# EAGLE schematic Schematic v9 (EAGLE 9.7.0)
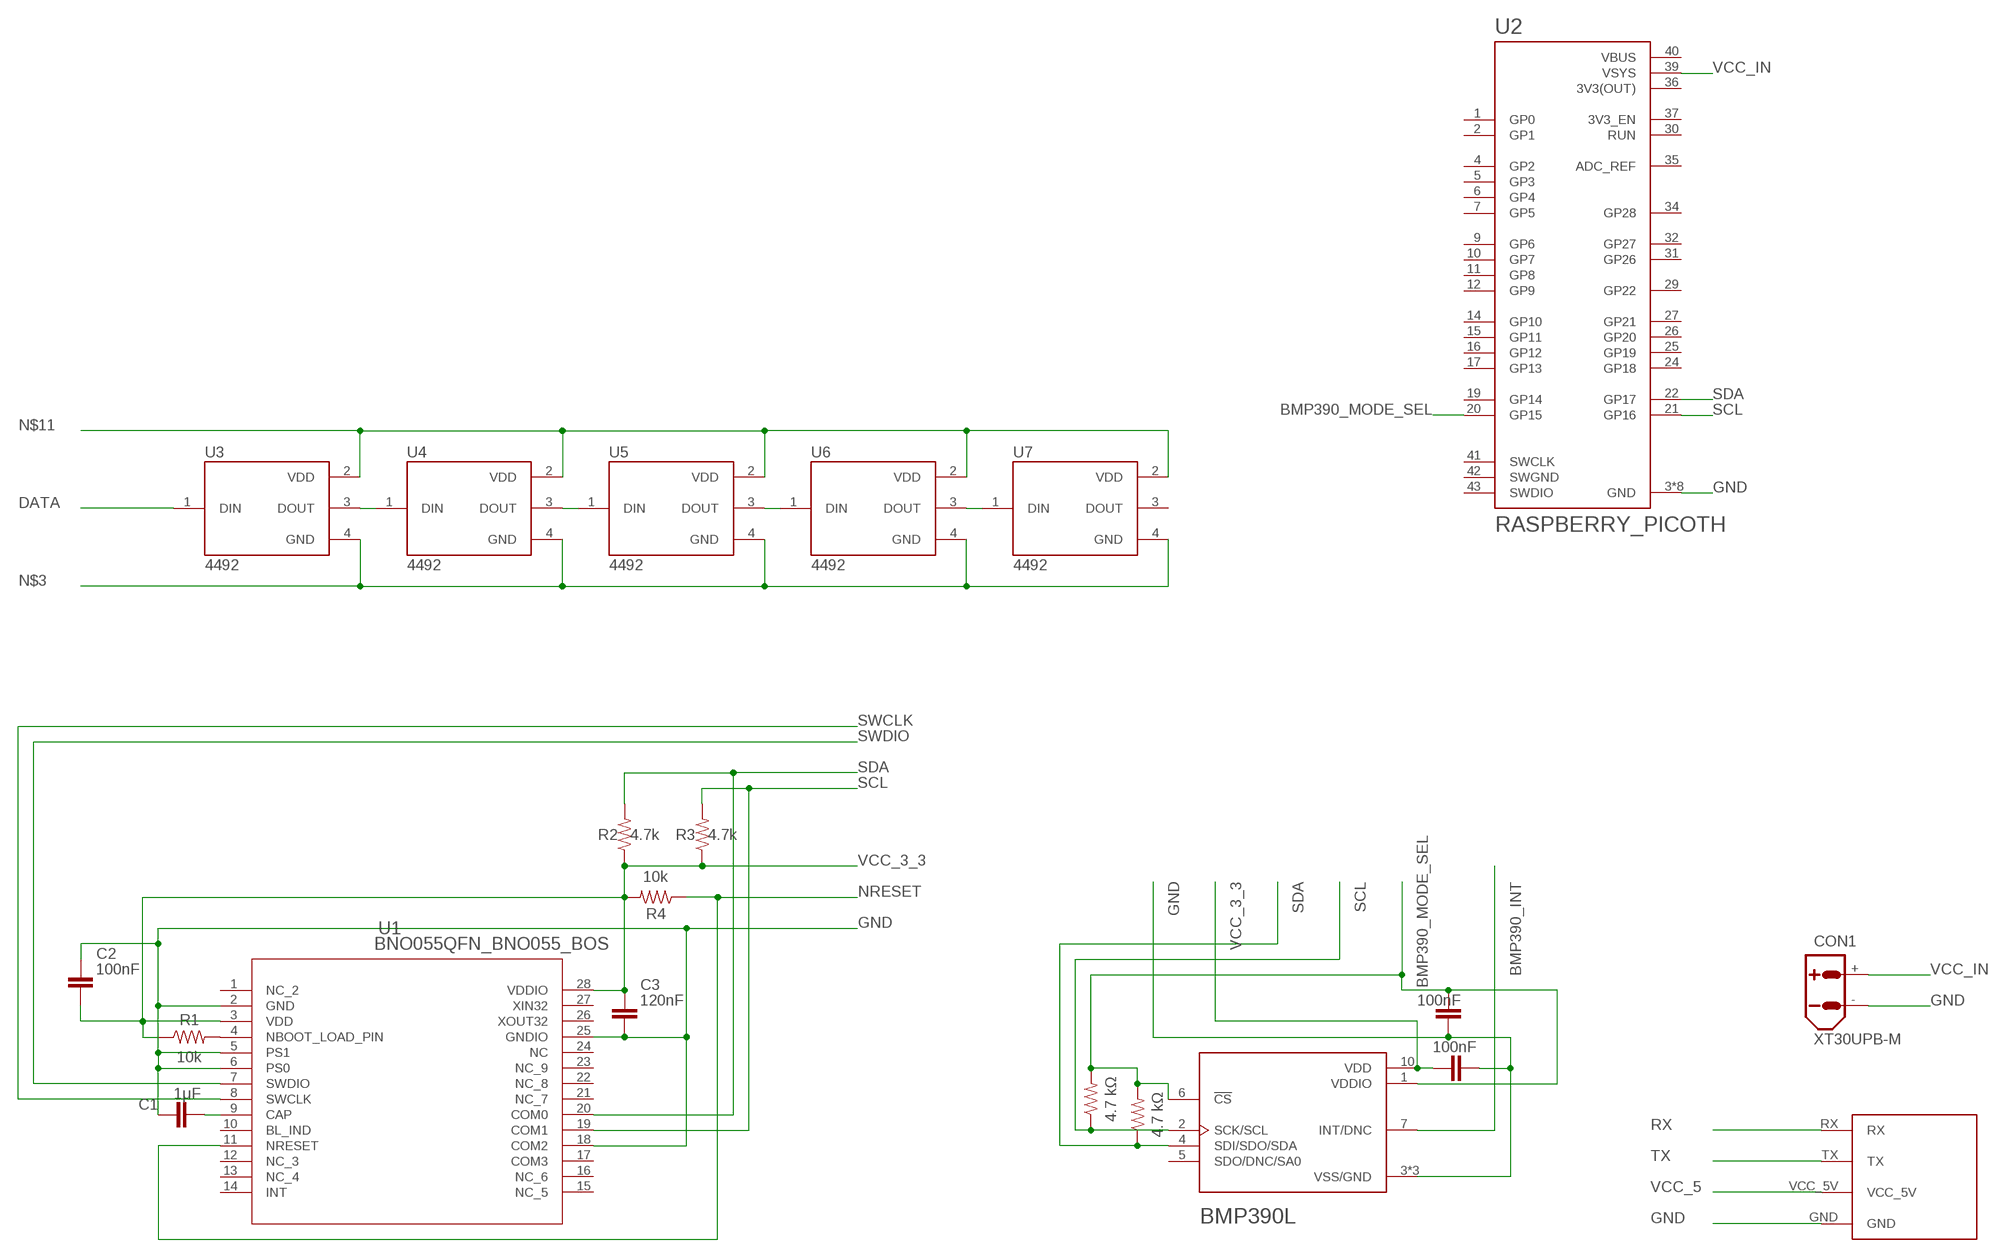
[diagram p0: schematic, sheet 1]

## Parts
C1  1μF  C_CHIP-1206(3216-METRIC)  [CAPC3216X135]
C2  100nF  C_CHIP-1206(3216-METRIC)  [CAPC3216X135]
C3  120nF  C_CHIP-1206(3216-METRIC)  [CAPC3216X135]
C4  100nF  C_CHIP-1206(3216-METRIC)  [CAPC3216X135]
C5  100nF  C_CHIP-1206(3216-METRIC)  [CAPC3216X135]
CON1  XT30UPB-M  [XT30UPB-M]
R1  10k  R-US_CHIP-1206(3216-METRIC)  [RESC3216X70]
R2  4.7k  R-US_CHIP-1206(3216-METRIC)  [RESC3216X70]
R3  4.7k  R-US_CHIP-1206(3216-METRIC)  [RESC3216X70]
R4  10k  R-US_CHIP-1206(3216-METRIC)  [RESC3216X70]
R5  4.7 kΩ  R-US_CHIP-1206(3216-METRIC)  [RESC3216X70]
R6  4.7 kΩ  R-US_CHIP-1206(3216-METRIC)  [RESC3216X70]
U1  BNO055QFN_BNO055_BOS  [QFN_BNO055_BOS]
U2  RASPBERRY_PICOTH  [PICO-PKG-TH]
U3  4492  [LED_4492]
U4  4492  [LED_4492]
U5  4492  [LED_4492]
U6  4492  [LED_4492]
U7  4492  [LED_4492]
U11  BMP390L  [XDCR_BMP390L]
U$1  EP1  [EP1_MODEL]

## Nets
BMP390_INT: U11.7(INT/DNC)
BMP390_MODE_SEL: C5.1 R5.2 R6.2 U2.20(GP15) U11.1(VDDIO) U11.6(!CS)
DATA: U3.1(DIN)
GND: C1.1 C2.1 C3.2 C4.2 C5.2 CON1.- U1.2(GND) U1.5(PS1) U1.6(PS0) U1.18(COM2) U1.25(GNDIO) U2.3(GND) U2.8(GND) U2.13(GND) U2.18(GND) U2.23(GND) U2.28(GND) U2.33(GND) U2.38(GND) U11.3(VSS/GND) U11.8(VSS/GND) U11.9(VSS/GND) U$1.GND
N$1: C1.2 U1.9(CAP)
N$2: R1.2 U1.4(NBOOT_LOAD_PIN)
N$3: U3.4(GND) U4.4(GND) U5.4(GND) U6.4(GND) U7.4(GND)
N$4: U3.3(DOUT) U4.1(DIN)
N$5: U4.3(DOUT) U5.1(DIN)
N$6: U5.3(DOUT) U6.1(DIN)
N$7: U6.3(DOUT) U7.1(DIN)
N$11: U3.2(VDD) U4.2(VDD) U5.2(VDD) U6.2(VDD) U7.2(VDD)
NRESET: R4.1 U1.11(NRESET)
RX: U$1.RX
SCL: R3.2 R5.1 U1.19(COM1) U2.21(GP16) U11.2(SCK/SCL)
SDA: R2.2 R6.1 U1.20(COM0) U2.22(GP17) U11.4(SDI/SDO/SDA)
SWCLK: U1.8(SWCLK)
SWDIO: U1.7(SWDIO)
TX: U$1.TX
VCC_3_3: C2.2 C3.1 C4.1 R1.1 R2.1 R3.1 R4.2 U1.3(VDD) U1.28(VDDIO) U11.10(VDD)
VCC_5: U$1.VCC_5V
VCC_IN: CON1.+ U2.39(VSYS)
Unconnected: U1.1(NC_2) U1.10(BL_IND) U1.12(NC_3) U1.13(NC_4) U1.14(INT) U1.15(NC_5) U1.16(NC_6) U1.17(COM3) U1.21(NC_7) U1.22(NC_8) U1.23(NC_9) U1.24(NC) U1.26(XOUT32) U1.27(XIN32) U2.1(GP0) U2.2(GP1) U2.4(GP2) U2.5(GP3) U2.6(GP4) U2.7(GP5) U2.9(GP6) U2.10(GP7) U2.11(GP8) U2.12(GP9) U2.14(GP10) U2.15(GP11) U2.16(GP12) U2.17(GP13) U2.19(GP14) U2.24(GP18) U2.25(GP19) U2.26(GP20) U2.27(GP21) U2.29(GP22) U2.30(RUN) U2.31(GP26) U2.32(GP27) U2.34(GP28) U2.35(ADC_REF) U2.37(3V3_EN) U2.41(SWCLK) U2.43(SWDIO) U7.3(DOUT) U11.5(SDO/DNC/SA0)

## Power pins joined to a net without a drawn wire
3V3(OUT): U2.36(3V3(OUT))
SWGND: U2.42(SWGND)
VBUS: U2.40(VBUS)

## Library data of the parts
C1-C5 = Capacitor:C: Capacitor - Generic; CATEGORY: Capacitor
CON1 = amass:XT30: AMASS XT30 connector Store in Japan AMASS XT30 connector <https://szc.jp/ams-xt30>
R1-R6 = Resistor:R-US: Resistor Fixed - ANSI; CATEGORY: Resistor; SUB-CATEGORY: Fixed
U1 = 2024-07-31_17-07-40_Library:BNO055; COPYRIGHT: Copyright (C) 2024 Ultra Librarian. All rights reserved.; MANUFACTURER_PART_NUMBER: BNO055; MFR_NAME: Bosch Sensortec
U2 = RPI Pico Eagle lib:RASPBERRY_PICO: Raspberry Pi Pico
U3-U7 = Adafruit 4492:4492: Check availability <https://pricing.snapeda.com/parts/4492/Adafruit/view-part?ref=eda>; AVAILABILITY: In Stock; CHECK_PRICES: https://www.snapeda.com/parts/4492/Adafruit+Industries/view-part/?ref=eda; DESCRIPTION: Adafruit Accessories NeoPixel Addressable 1515 LEDs (1.5mm x 1.5mm) - 10 pack - SK6805-E-J; MF: Adafruit; MP: 4492; PACKAGE: None; PRICE: None; PURCHASE-URL: https://www.snapeda.com/api/url_track_click_mouser/?unipart_id=6292704&manufacturer=Adafruit&part_name=4492&search_term=neopixel; SNAPEDA_LINK: https://www.snapeda.com/parts/4492/Adafruit+Industries/view-part/?ref=snap
U11 = BMP390L footprint symbol:BMP390L: Check availability <https://pricing.snapeda.com/parts/BMP390L/Bosch%20Sensortec/view-part?ref=eda>; AVAILABILITY: In Stock; CHECK_PRICES: https://www.snapeda.com/parts/BMP390L/Bosch+Sensortec/view-part/?ref=eda; DESCRIPTION: Pressure Sensor Development Tools Evaluation Shuttle Board for the BMP390L; MF: Bosch Sensortec; MP: BMP390L; PACKAGE: None; PRICE: None; PURCHASE-URL: https://www.snapeda.com/api/url_track_click_mouser/?unipart_id=4817101&manufacturer=Bosch Sensortec&part_name=BMP390L&search_term=bmp390; SNAPEDA_LINK: https://www.snapeda.com/parts/BMP390L/Bosch+Sensortec/view-part/?ref=snap
U$1 = Happymodel ELRS EP1 RX:EP1